# Altium schematic sheet 2012_AVR.SchDoc
size A3
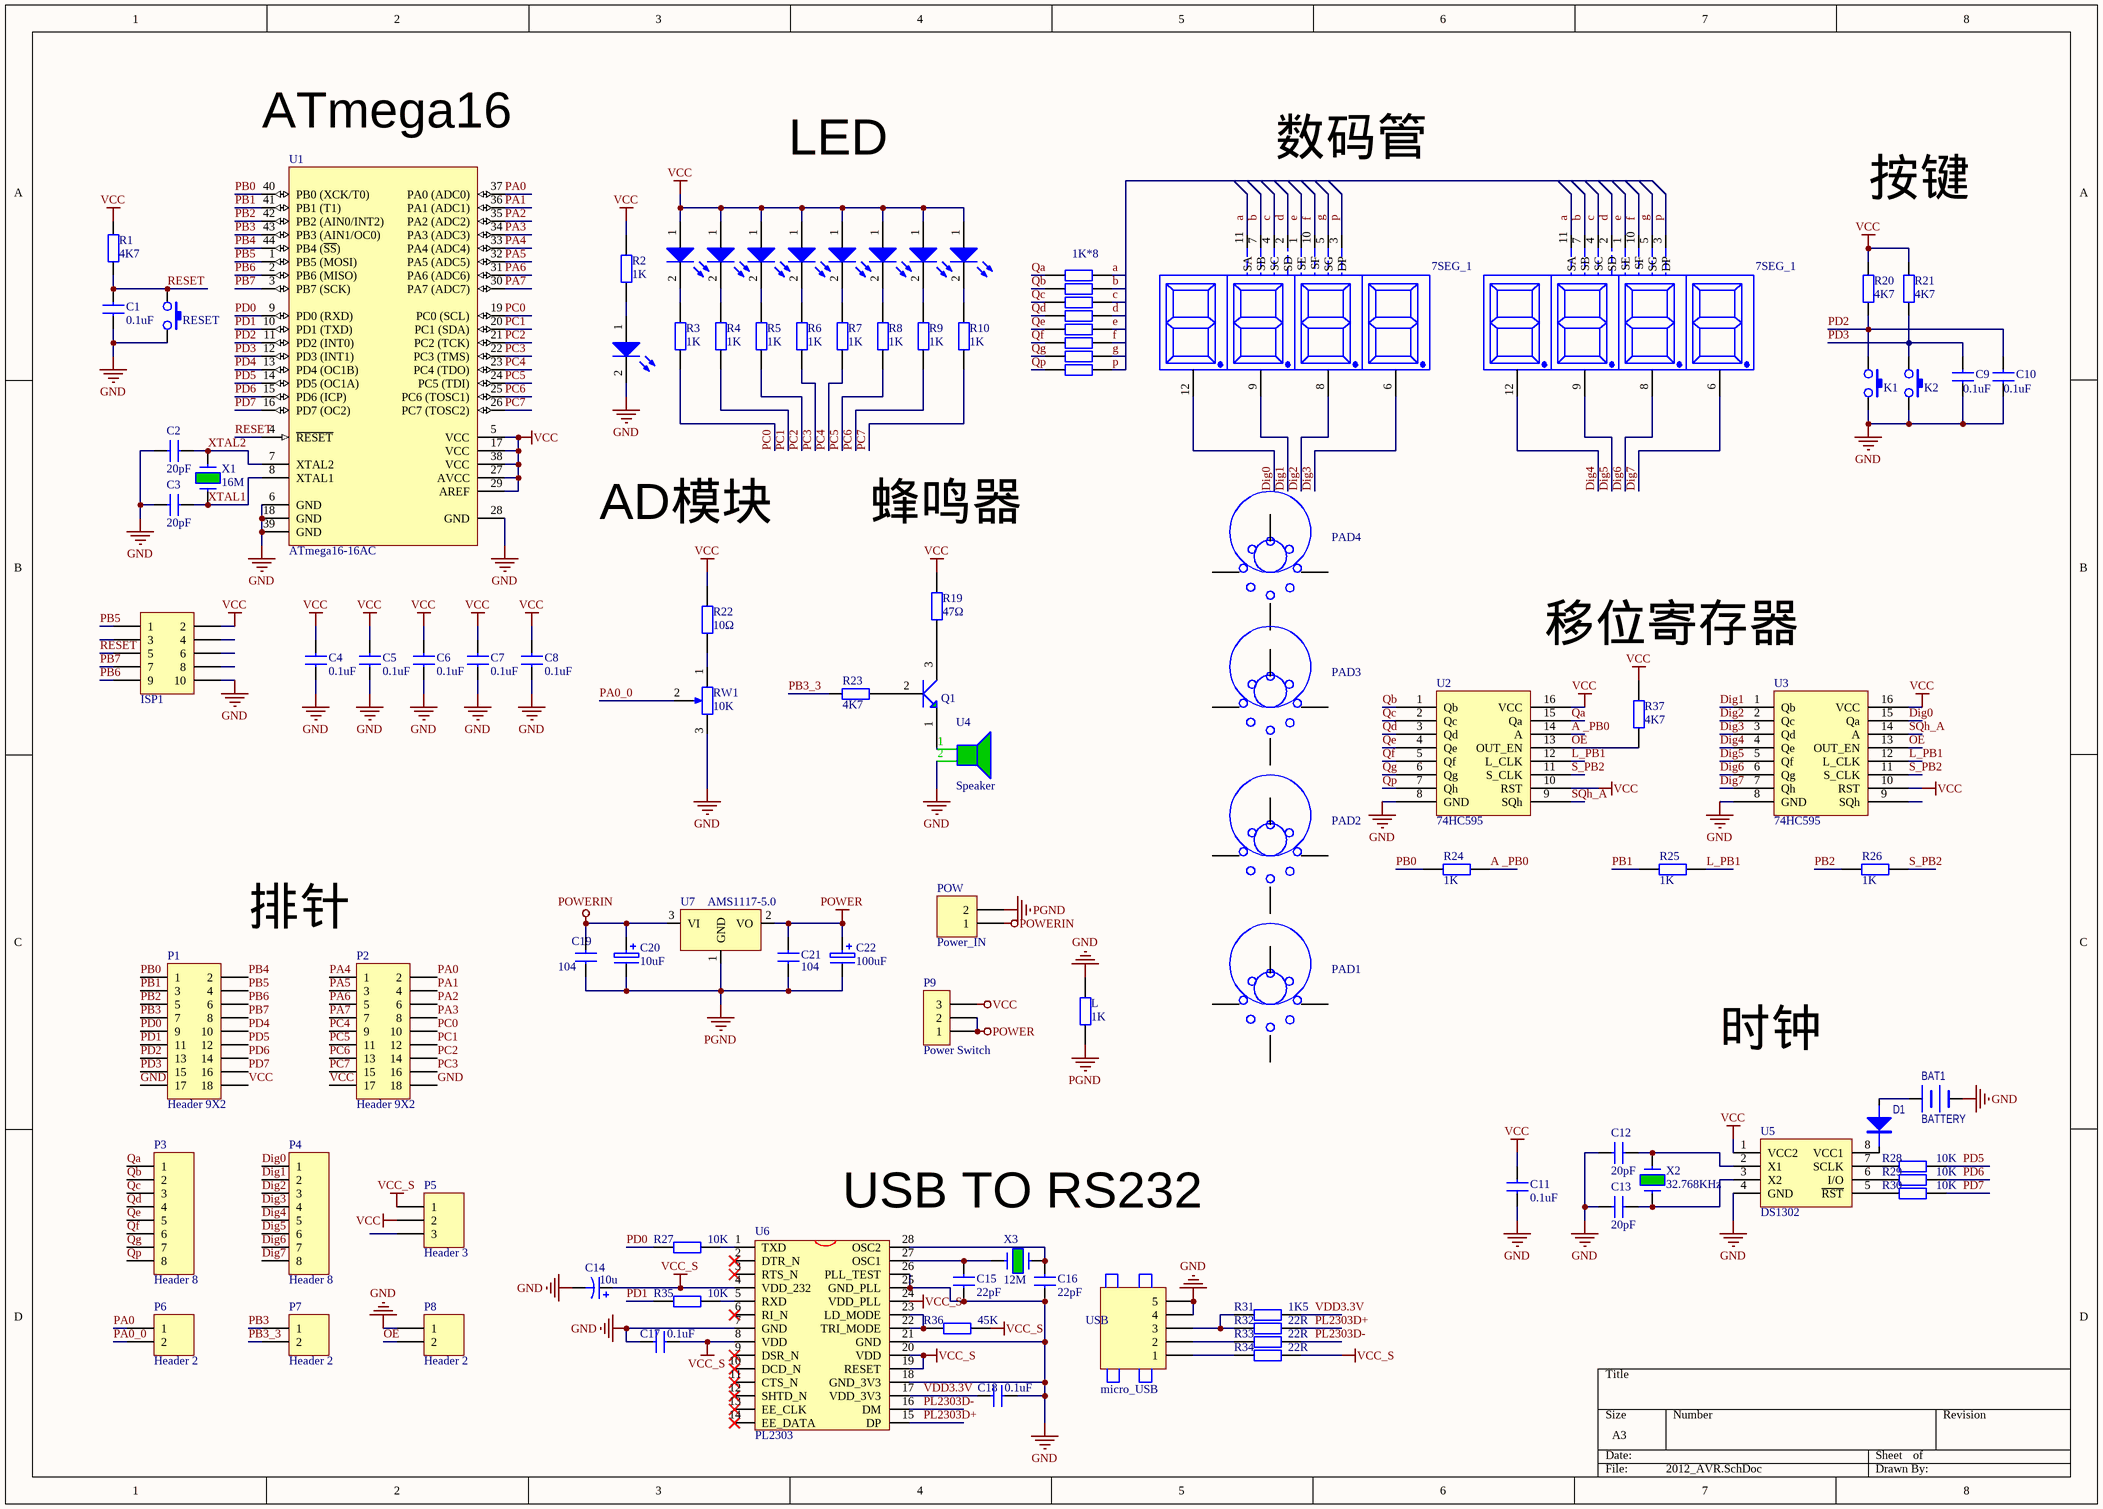
[diagram p0: 2012_AVR.SchDoc]

## Parts
1  7SEG_1  [DSP-4]
2  7SEG_1  [DSP-4]
BAT1  BATTERY  [BAT600]
C1  0.1uF  [C0704]
C2  20pF  [C0704]
C3  20pF  [C0704]
C4  0.1uF  [C0704]
C5  0.1uF  [C0704]
C6  0.1uF  [C0704]
C7  0.1uF  [C0704]
C8  0.1uF  [C0704]
C9  0.1uF  [C0704]
C10  0.1uF  [C0704]
C11  0.1uF  [C0704]
C12  20pF  [C0704]
C13  20pF  [C0704]
C14  value 10u  [3216C]  (hidden comment: Cap Pol1)
C15  22pF  [C0704]
C16  22pF  [C0704]
C17  0.1uF  [C0704]
C18  0.1uF  [C0704]
C19  104  [0805]
C20  10uF  [3216C]
C21  104  [0805]
C22  100uF  [3216C]
D1  1N4148  [D1206]  (value not drawn)
ISP1  ISP2*5  [ISP(2*5)]  (value not drawn)
K1  SWITCH-PB1  [SW-6-6]  (value not drawn)
K2  SWITCH-PB1  [SW-6-6]  (value not drawn)
L  1K  [0805]
LED0  LED  [1210LED]  (value not drawn)
LED1  LED  [1210LED]  (value not drawn)
LED2  LED  [1210LED]  (value not drawn)
LED3  LED  [1210LED]  (value not drawn)
LED4  LED  [1210LED]  (value not drawn)
LED5  LED  [1210LED]  (value not drawn)
LED6  LED  [1210LED]  (value not drawn)
LED7  LED  [1210LED]  (value not drawn)
P1  Header 9X2  [HDR2X9]
P2  Header 9X2  [HDR2X9]
P3  Header 8  [HDR1X8]
P4  Header 8  [HDR1X8]
P5  Header 3  [HDR1X3]
P6  Header 2  [HDR1X2]
P7  Header 2  [HDR1X2]
P8  Header 2  [HDR1X2]
P9  Power Switch  [HDR1X3]
PAD1  hotpad  [hot_pad]  (value not drawn)
PAD2  hotpad  [hot_pad]  (value not drawn)
PAD3  hotpad  [hot_pad]  (value not drawn)
PAD4  hotpad  [hot_pad]  (value not drawn)
POW  Power_IN  [BAT_PORT]
POWER  LED  [1210LED]  (value not drawn)
Q1  1AMNPN9013  [CHIP]  (value not drawn)
R1  value 4K7  [R0704]  (hidden comment: Res2)
R2  1K  [R0704]
R3  1K  [R0704]
R4  1K  [R0704]
R5  1K  [R0704]
R6  1K  [R0704]
R7  1K  [R0704]
R8  1K  [R0704]
R9  1K  [R0704]
R10  1K  [R0704]
R11  1K*8  [R0704]
R12  1K  [R0704]  (value not drawn)
R13  1K  [R0704]  (value not drawn)
R14  1K  [R0704]  (value not drawn)
R15  1K  [R0704]  (value not drawn)
R16  1K  [R0704]  (value not drawn)
R17  1K  [R0704]  (value not drawn)
R18  1K  [R0704]  (value not drawn)
R19  value 47Ω  [R0704]  (hidden comment: 1K)
R20  value 4K7  [R0704]  (hidden comment: Res2)
R21  value 4K7  [R0704]  (hidden comment: Res2)
R22  value 10Ω  [R0704]  (hidden comment: 1K)
R23  value 4K7  [R0704]  (hidden comment: Res2)
R24  1K  [R0704]
R25  1K  [R0704]
R26  1K  [R0704]
R27  value 10K  [R0704]  (hidden comment: 20)
R28  value 10K  [R0704]  (hidden comment: 1K)
R29  value 10K  [R0704]  (hidden comment: 1K)
R30  value 10K  [R0704]  (hidden comment: 1K)
R31  value 1K5  [R0704]  (hidden comment: 1K)
R32  value 22R  [R0704]  (hidden comment: 1K)
R33  value 22R  [R0704]  (hidden comment: 1K)
R34  22R  [R0704]
R35  value 10K  [R0704]  (hidden comment: 1K)
R36  value 45K  [R0704]  (hidden comment: 1K)
R37  value 4K7  [R0704]  (hidden comment: 1K)
RESET  SWITCH-PB1  [SW-6-6]  (value not drawn)
RW1  value 10K  [RW]  (hidden comment: RPOT)
U1  ATmega16-16AC  [mega16 tie]
U2  74HC595  [SOP16]
U3  74HC595  [SOP16]
U4  Speaker  [SPEAKER]
U5  DS1302  [SO-8]
U6  PL2303  [ssop28]
U7  AMS1117-5.0  [DSO-G3]
USB  micro_USB  [USBfoot]
X1  16M  [XTAL]
X2  32.768KHz  [XTAL-B]
X3  12M  [XTAL]

## Nets
GND: BAT1.2 C1.2 C2.1 C3.1 C4.1 C5.1 C6.1 C7.1 C8.1 C9.1 C10.1 C11.1 C12.1 C13.1 C14.2 C15.2 C16.2 C17.2 C18.1 ISP1.10 K1.2 K2.2 L.2 P1.17 P2.18 P8.1 POWER.2 RESET.2 RW1.3 U1.6(GND) U1.18(GND) U1.28(GND) U1.39(GND) U2.8(GND) U3.8(GND) U4.2 U5.4(GND) U6.7(GND) U6.18(GND_3V3) U6.21(GND) U6.25(GND_PLL) U6.26(PLL_TEST) USB.4 USB.5
PGND: C19.2 C20.2 C21.2 C22.2 L.1 POW.2 U7.1(GND)
POWER: C21.1 C22.1 P9.1 P9.2 U7.2(VO)
POWERIN: C19.1 C20.1 POW.1 U7.3(VI)
VCC: C4.2 C5.2 C6.2 C7.2 C8.2 C11.2 ISP1.2 LED0.1 LED1.1 LED2.1 LED3.1 LED4.1 LED5.1 LED6.1 LED7.1 P1.18 P2.17 P5.2 P9.3 R1.2 R2.1 R19.1 R20.1 R21.1 R22.1 R37.1 U1.5(VCC) U1.17(VCC) U1.27(AVCC) U1.29(AREF) U1.38(VCC) U2.10(RST) U2.16(VCC) U3.10(RST) U3.16(VCC) U5.1(VCC2)
VCC_S: C14.1 C17.1 P5.1 R34.1 R36.1 U6.4(VDD_232) U6.8(VDD) U6.19(RESET) U6.20(VDD) U6.24(VDD_PLL)
a: 1.11(SA) 2.11(SA) R11.2
A _PB0: R24.1 U2.14(A)
b: 1.7(SB) 2.7(SB) R12.2
c: 1.4(SC) 2.4(SC) R13.2
d: 1.2(SD) 2.2(SD) R14.2
Dig0: 1.12(GID4) P4.1 U3.15(Qa)
Dig1: 1.9(DIG3) P4.2 U3.1(Qb)
Dig2: 1.8(DIG2) P4.3 U3.2(Qc)
Dig3: 1.6(GIG1) P4.4 U3.3(Qd)
Dig4: 2.12(GID4) P4.5 U3.4(Qe)
Dig5: 2.9(DIG3) P4.6 U3.5(Qf)
Dig6: 2.8(DIG2) P4.7 U3.6(Qg)
Dig7: 2.6(GIG1) P4.8 U3.7(Qh)
e: 1.1(SE) 2.1(SE) R15.2
f: 1.10(SF) 2.10(SF) R16.2
g: 1.5(SG) 2.5(SG) R17.2
L_PB1: R25.1 U2.12(L_CLK) U3.12(L_CLK)
OE: P8.2 R37.2 U2.13(OUT_EN) U3.13(OUT_EN)
p: 1.3(DP) 2.3(DP) R18.2
PA0: P2.2 P6.1 U1.37(PA0_(ADC0))
PA0_0: P6.2 RW1.2
PA1: P2.4 U1.36(PA1_(ADC1))
PA2: P2.6 U1.35(PA2_(ADC2))
PA3: P2.8 U1.34(PA3_(ADC3))
PA4: P2.1 U1.33(PA4_(ADC4))
PA5: P2.3 U1.32(PA5_(ADC5))
PA6: P2.5 U1.31(PA6_(ADC6))
PA7: P2.7 U1.30(PA7_(ADC7))
PB0: P1.1 R24.2 U1.40(PB0_(XCK/T0))
PB1: P1.3 R25.2 U1.41(PB1_(T1))
PB2: P1.5 R26.2 U1.42(PB2_(AIN0/INT2))
PB3: P1.7 P7.1 U1.43(PB3_(AIN1/OC0))
PB3_3: P7.2 R23.2
PB4: P1.2 U1.44(PB4_(~{SS}))
PB5: ISP1.1 P1.4 U1.1(PB5_(MOSI))
PB6: ISP1.9 P1.6 U1.2(PB6_(MISO))
PB7: ISP1.7 P1.8 U1.3(PB7_(SCK))
PC0: P2.10 R3.2 U1.19(PC0_(SCL))
PC1: P2.12 R4.2 U1.20(PC1_(SDA))
PC2: P2.14 R5.2 U1.21(PC2_(TCK))
PC3: P2.16 R6.2 U1.22(PC3_(TMS))
PC4: P2.9 R7.2 U1.23(PC4_(TDO))
PC5: P2.11 R8.2 U1.24(PC5_(TDI))
PC6: P2.13 R9.2 U1.25(PC6_(TOSC1))
PC7: P2.15 R10.2 U1.26(PC7_(TOSC2))
PD0: P1.9 R27.2 U1.9(PD0_(RXD))
PD1: P1.11 R35.2 U1.10(PD1_(TXD))
PD2: C10.2 K1.1 P1.13 R20.2 U1.11(PD2_(INT0))
PD3: C9.2 K2.1 P1.15 R21.2 U1.12(PD3_(INT1))
PD4: P1.10 U1.13(PD4_(OC1B))
PD5: P1.12 R28.1 U1.14(PD5_(OC1A))
PD6: P1.14 R29.1 U1.15(PD6_(ICP))
PD7: P1.16 R30.1 U1.16(PD7_(OC2))
PL2303D+: R32.1 U6.15(DP)
PL2303D-: R33.1 U6.16(DM)
Qa: P3.1 R11.1 U2.15(Qa)
Qb: P3.2 R12.1 U2.1(Qb)
Qc: P3.3 R13.1 U2.2(Qc)
Qd: P3.4 R14.1 U2.3(Qd)
Qe: P3.5 R15.1 U2.4(Qe)
Qf: P3.6 R16.1 U2.5(Qf)
Qg: P3.7 R17.1 U2.6(Qg)
Qp: P3.8 R18.1 U2.7(Qh)
RESET: C1.1 ISP1.5 R1.1 RESET.1 U1.4(~{RESET})
S_PB2: R26.1 U2.11(S_CLK) U3.11(S_CLK)
SQh_A: U2.9(SQh) U3.14(A)
VDD3.3V: C18.2 R31.2 U6.17(VDD_3V3)
XTAL1: C3.2 U1.8(XTAL1) X1.1
XTAL2: C2.2 U1.7(XTAL2) X1.2
NetBAT1_1: BAT1.1 D1.1
NetC12_2: C12.2 U5.2(X1) X2.1
NetC13_2: C13.2 U5.3(X2) X2.2
NetC15_1: C15.1 U6.27(OSC1) X3.1
NetC16_1: C16.1 U6.28(OSC2) X3.2
NetD1_2: D1.2 U5.8(VCC1)
NetLED0_2: LED0.2 R3.1
NetLED1_2: LED1.2 R4.1
NetLED2_2: LED2.2 R5.1
NetLED3_2: LED3.2 R6.1
NetLED4_2: LED4.2 R7.1
NetLED5_2: LED5.2 R8.1
NetLED6_2: LED6.2 R9.1
NetLED7_2: LED7.2 R10.1
NetPOWER_1: POWER.1 R2.2
NetQ1_1: Q1.1 U4.1
NetQ1_2: Q1.2 R23.1
NetQ1_3: Q1.3 R19.2
NetR22_2: R22.2 RW1.1
NetR27_1: R27.1 U6.1(TXD)
NetR28_2: R28.2 U5.7(SCLK)
NetR29_2: R29.2 U5.6(I/O)
NetR30_2: R30.2 U5.5(~{RST})
NetR31_1: R31.1 R32.2 USB.3
NetR33_2: R33.2 USB.2
NetR34_2: R34.2 USB.1
NetR35_1: R35.1 U6.5(RXD)
NetR36_2: R36.2 U6.22(TRI_MODE) U6.23(LD_MODE)

Not connected (* = marked no-connect by the designer): ISP1 3 4 6 8; P5 3; PAD1 1(0) 2(1) 3(2) 4(3); PAD2 1(0) 2(1) 3(2) 4(3); PAD3 1(0) 2(1) 3(2) 4(3); PAD4 1(0) 2(1) 3(2) 4(3); U3 9(SQh); U6 2(DTR_N)* 3(RTS_N)* 6(RI_N)* 9(DSR_N)* 10(DCD_N)* 11(CTS_N)* 12(SHTD_N)* 13(EE_CLK)* 14(EE_DATA)*

## Notes on the sheet
- ATmega16
- LED
- 数码管
- 按键
- AD模块
- 蜂鸣器
- 移位寄存器
- 排针
- 时钟
- USB TO RS232

## Library data of the parts
1 2 = 四位共阴数码管
C1-C13 C15-C19 C21 = CAP: Capacitor
  C19 C21: Value: 104
C14 = Cap Pol1: Polarized Capacitor (Radial); Published: 8-Jun-2000; LatestRevisionDate: 17-Jul-2002; LatestRevisionNote: Re-released for DXP Platform.; PackageReference: RB7.6-15; Publisher: Altium Limited
C20 C22 = ELECTRO: Electrolytic Capacitor
D1 = DIODE
ISP1 = ISP2*5: Header, 5-Pin, Dual row; LatestRevisionDate: 17-Jul-2002; LatestRevisionNote: Re-released for DXP Platform.; Publisher: Altium Limited
L R2-R10 R12-R19 R22 R24-R37 = RES: Resistor; Manufacturer: Generic Components; Class: Passive; Published: 08/06/2000; Publisher: Altium Hobart Technology Centre; SubClass: Resistor
  L R2-R10 R12-R18 R24-R26: Value: 1K
  R34: Value: 22R
LED0-LED7 POWER = LED: Typical BLUE SiC LED; Manufacturer: Generic Components; Class: Optoelectronic; Published: 08/06/2000; Publisher: Altium Hobart Technology Centre; SubClass: LED
P1 P2 = Header 9X2: Header, 9-Pin, Dual row; LatestRevisionDate: 17-Jul-2002; LatestRevisionNote: Re-released for DXP Platform.; Publisher: Altium Limited
P3 P4 = Header 8: Header, 8-Pin; LatestRevisionDate: 17-Jul-2002; LatestRevisionNote: Re-released for DXP Platform.; Publisher: Altium Limited
P5 = Header 3: Header, 3-Pin; LatestRevisionDate: 17-Jul-2002; LatestRevisionNote: Re-released for DXP Platform.; Publisher: Altium Limited
P6-P8 POW = Header 2: Header, 2-Pin; LatestRevisionDate: 17-Jul-2002; LatestRevisionNote: Re-released for DXP Platform.; Publisher: Altium Limited
P9 = CON3: Connector
PAD1-PAD4 = HOT_PAD
Q1 = 9013
R1 R20 R21 R23 = Res2: Resistor; Published: 8-Jun-2000; LatestRevisionDate: 17-Jul-2002; LatestRevisionNote: Re-released for DXP Platform.; PackageReference: AXIAL-0.4; Publisher: Altium Limited
R11 = RES: Resistor; Manufacturer: Generic Components; Class: Passive; Value: 1K; Published: 08/06/2000; Publisher: Altium Hobart Technology Centre; SubClass: Resistor
RW1 = RPOT: Potentiometer; Manufacturer: Generic Components; Class: Passive; Set Position: 0.5; Published: 08/06/2000; Publisher: Altium Hobart Technology Centre; SubClass: Potentiometer
U1 = ATmega16-16AC: 8-Bit AVR Microcontroller with 16K Bytes of In-System Programmable Flash Memory; Package Information: Latest Revision: 1995; Published: 17-Sep-2003; Revision: 17-Dec-2003: PCB Footprint updated; Datasheet: Latest Revision: 2466E-AVR-10/02; Package Reference: 44A; Publisher: Altium Limited
U2 U3 = 74HC595_1
U7 = AS1117
USB = micro_USB: 手机用
X1 X3 = CRYSTAL
X2 = CRYSTAL_1: Crystal